# EAGLE design LoRa PiHat v.1 (EAGLE 9.5.2)
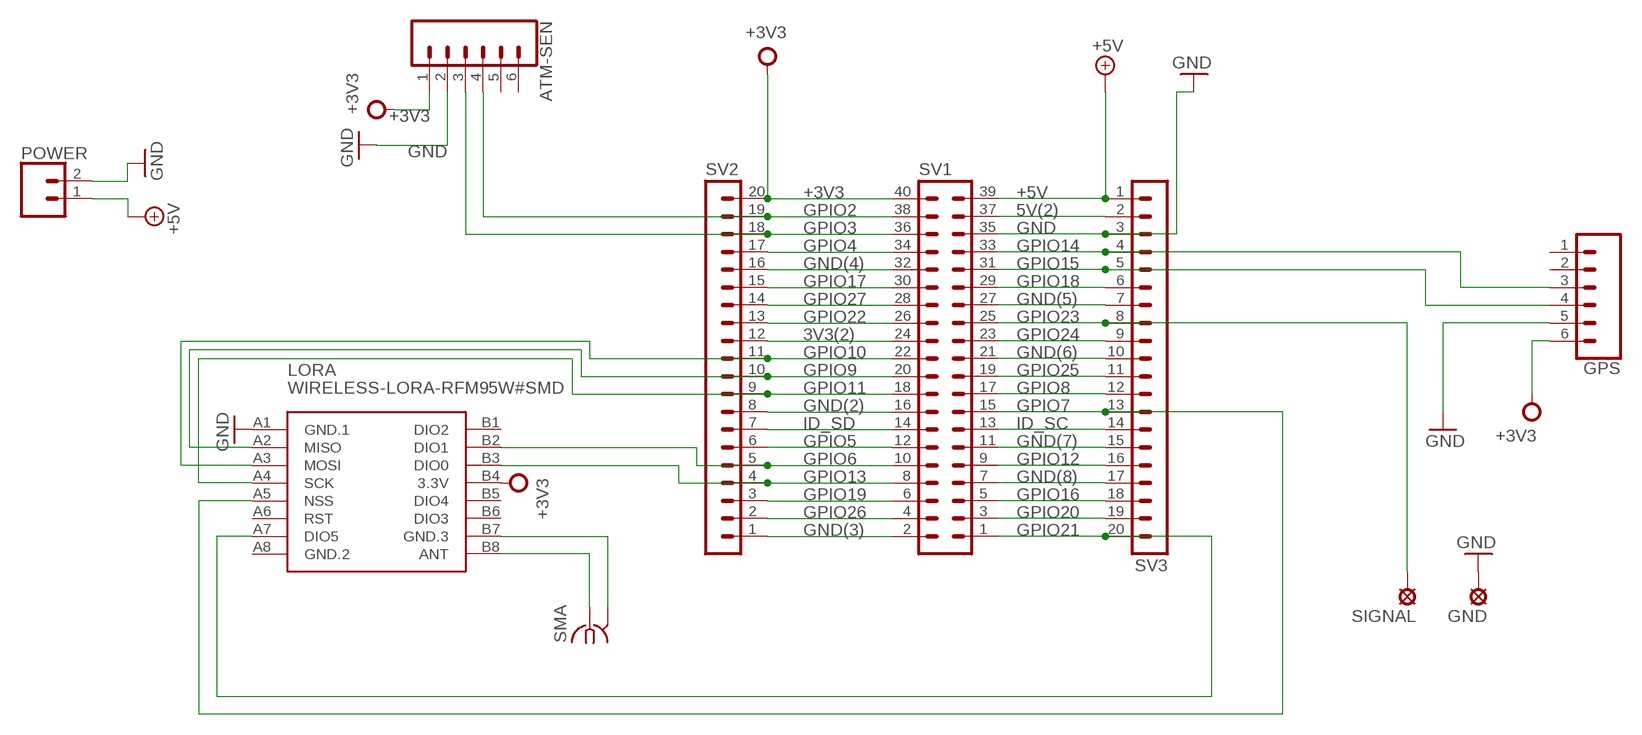
[diagram p0: schematic, sheet 1]

## Parts
ATM-SEN  CONN_06NO_SILK_NO_POP  [1X06_NO_SILK]
GND  LSP10  [LSP10]
GPS  CONN_06NO_SILK_NO_POP  [1X06_NO_SILK]
LORA  WIRELESS-LORA-RFM95W#SMD  [WIRELESS-LORA-RFM95W#SMD]
POWER  CONN_02  [1X02]
SIGNAL  LSP10  [LSP10]
SMA  BU-SMA-V  [BU-SMA-V]
SV1  MA20-2  [MA20-2]
SV2  MA20-1L  [MA20-1L]
SV3  MA20-1L  [MA20-1L]

## Nets
3V3(2): SV1.24 SV2.12
5V(2): SV1.37 SV3.2
+3V3: ATM-SEN.1 GPS.6 LORA.B4(3.3V) SV1.40 SV2.20
+5V: POWER.1 SV1.39 SV3.1
GND: ATM-SEN.2 GND.MP GPS.5 LORA.A1(GND.1) POWER.2 SV1.35 SV3.3
GND(2): SV1.16 SV2.8
GND(3): SV1.2 SV2.1
GND(4): SV1.32 SV2.16
GND(5): SV1.27 SV3.7
GND(6): SV1.21 SV3.10
GND(7): SV1.11 SV3.15
GND(8): SV1.7 SV3.17
GPIO2: ATM-SEN.4 SV1.38 SV2.19
GPIO3: ATM-SEN.3 SV1.36 SV2.18
GPIO4: SV1.34 SV2.17
GPIO5: SV1.12 SV2.6
GPIO6: LORA.B2(DIO1) SV1.10 SV2.5
GPIO7: LORA.A5(NSS) SV1.15 SV3.13
GPIO8: SV1.17 SV3.12
GPIO9: LORA.A2(MISO) SV1.20 SV2.10
GPIO10: LORA.A3(MOSI) SV1.22 SV2.11
GPIO11: LORA.A4(SCK) SV1.18 SV2.9
GPIO12: SV1.9 SV3.16
GPIO13: LORA.B3(DIO0) SV1.8 SV2.4
GPIO14: GPS.3 SV1.33 SV3.4
GPIO15: GPS.4 SV1.31 SV3.5
GPIO16: SV1.5 SV3.18
GPIO17: SV1.30 SV2.15
GPIO18: SV1.29 SV3.6
GPIO19: SV1.6 SV2.3
GPIO20: SV1.3 SV3.19
GPIO21: LORA.A7(DIO5) SV1.1 SV3.20
GPIO22: SV1.26 SV2.13
GPIO23: SIGNAL.MP SV1.25 SV3.8
GPIO24: SV1.23 SV3.9
GPIO25: SV1.19 SV3.11
GPIO26: SV1.4 SV2.2
GPIO27: SV1.28 SV2.14
ID_SC: SV1.13 SV3.14
ID_SD: SV1.14 SV2.7
N$1: LORA.B8(ANT) SMA.1
N$2: LORA.B7(GND.3) SMA.2 SMA.3 SMA.4 SMA.5
Unconnected: ATM-SEN.5 ATM-SEN.6 GPS.1 GPS.2 LORA.A6(RST) LORA.B1(DIO2) LORA.B5(DIO4) LORA.B6(DIO3)

## Power pins joined to a net without a drawn wire
GND.2: LORA.A8(GND.2)

## Library data of the parts
ATM-SEN GPS = SparkFun-Connectors:CONN_06: Multi connection point. Often used as Generic Header-pin footprint for 0.1 inch spaced/style header connections On any of the 0.1 inch spaced packages, you can populate with these: Break Away Headers - Straight <https://www.sparkfun.com/products/116> (PRT-00116) Break Away Male Headers - Right Angle <https://www.sparkfun.com/products/553> (PRT-00553) Female Headers <https://www.sparkfun.com/products/115> (PRT-00115) Break Away Headers - Machine Pin <https://www.sparkfun.com/products/117> (PRT-00117) Break Away Female Headers - Swiss Machine Pin <https://www.sparkfun.com/products/743> (PRT-00743) Arduino Stackable Header - 6 Pin <https://www.sparkfun.com/products/9280> (PRT-09280) For SCREWTERMINALS and SPRING TERMINALS visit here: Screw Terimnals on SparkFun.com <https://www.sparkfun.com/search/results?term=Screw+Terminals> (5mm/3.5mm/2.54mm spacing) This device is also useful as a general connection point to wire up your design to another part of your project. Our various solder wires solder well into these plated through hole pads. Hook-Up Wire - Assortment (Stranded, 22 AWG) <https://www.sparkfun.com/products/11375> (PRT-11375) Hook-Up Wire - Assortment (Solid Core, 22 AWG) <https://www.sparkfun.com/products/11367> (PRT-11367) View the entire wire category on our website here <https://www.sparkfun.com/categories/141>
GND SIGNAL = solpad:LSP10: SOLDER PAD drill 1.0 mm, distributor Buerklin, 12H555
LORA = diy-modules:WIRELESS-LORA-RFM95W: 868/915 MHz LoRa Radio Transceiver Module based on SX1276 chip Click here to find device on ebay.com <http://www.ebay.com/sch/RFM95W+transceiver>
POWER = SparkFun-Connectors:CONN_02: Multi connection point. Often used as Generic Header-pin footprint for 0.1 inch spaced/style header connections On any of the 0.1 inch spaced packages, you can populate with these: Break Away Headers - Straight <https://www.sparkfun.com/products/116> (PRT-00116) Break Away Male Headers - Right Angle <https://www.sparkfun.com/products/553> (PRT-00553) Female Headers <https://www.sparkfun.com/products/115> (PRT-00115) Break Away Headers - Machine Pin <https://www.sparkfun.com/products/117> (PRT-00117) Break Away Female Headers - Swiss Machine Pin <https://www.sparkfun.com/products/743> (PRT-00743) For SCREWTERMINALS and SPRING TERMINALS visit here: Screw Terimnals on SparkFun.com <https://www.sparkfun.com/search/results?term=Screw+Terminals> (5mm/3.5mm/2.54mm spacing) This device is also useful as a general connection point to wire up your design to another part of your project. Our various solder wires solder well into these plated through hole pads. Hook-Up Wire - Assortment (Stranded, 22 AWG) <https://www.sparkfun.com/products/11375> (PRT-11375) Hook-Up Wire - Assortment (Solid Core, 22 AWG) <https://www.sparkfun.com/products/11367> (PRT-11367) View the entire wire category on our website here <https://www.sparkfun.com/categories/141> Special notes: Molex polarized connector foot print use with: PRT-08233 with associated crimp pins and housings. 2.54_SCREWTERM for use with PRT-10571. 3.5mm Screw Terminal footprints for PRT-08084 5mm Screw Terminal footprints for use with PRT-08432
SMA = con-coax:BU-SMA-V: FEMALE SMA CONNECTOR Radiall distributor RS 112-3794; OC_FARNELL: unknown; OC_NEWARK: unknown
SV1 = con-lstb:MA20-2: PIN HEADER; OC_FARNELL: unknown; OC_NEWARK: unknown
SV2 SV3 = con-lstb:MA20-1L: PIN HEADER; OC_FARNELL: unknown; OC_NEWARK: unknown

## Board
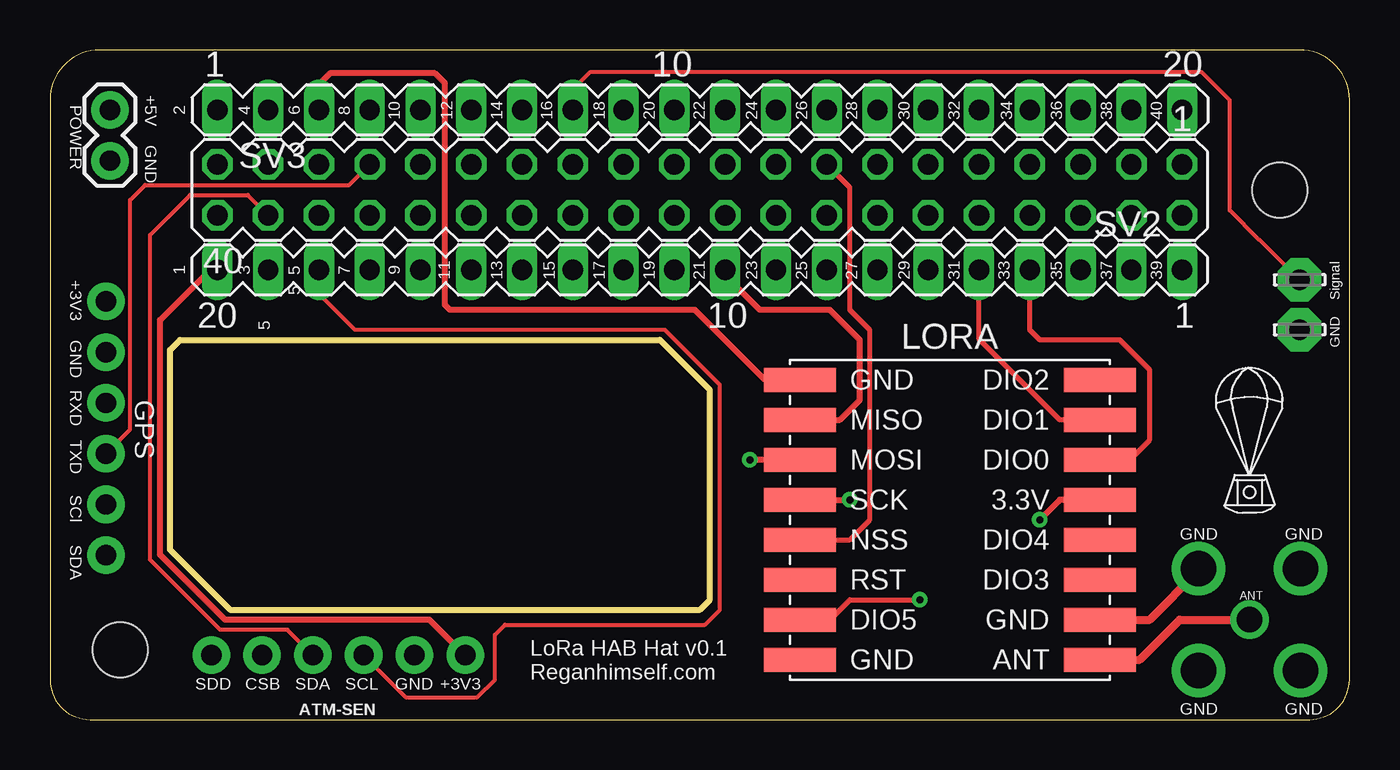
[diagram p1: board, top side]
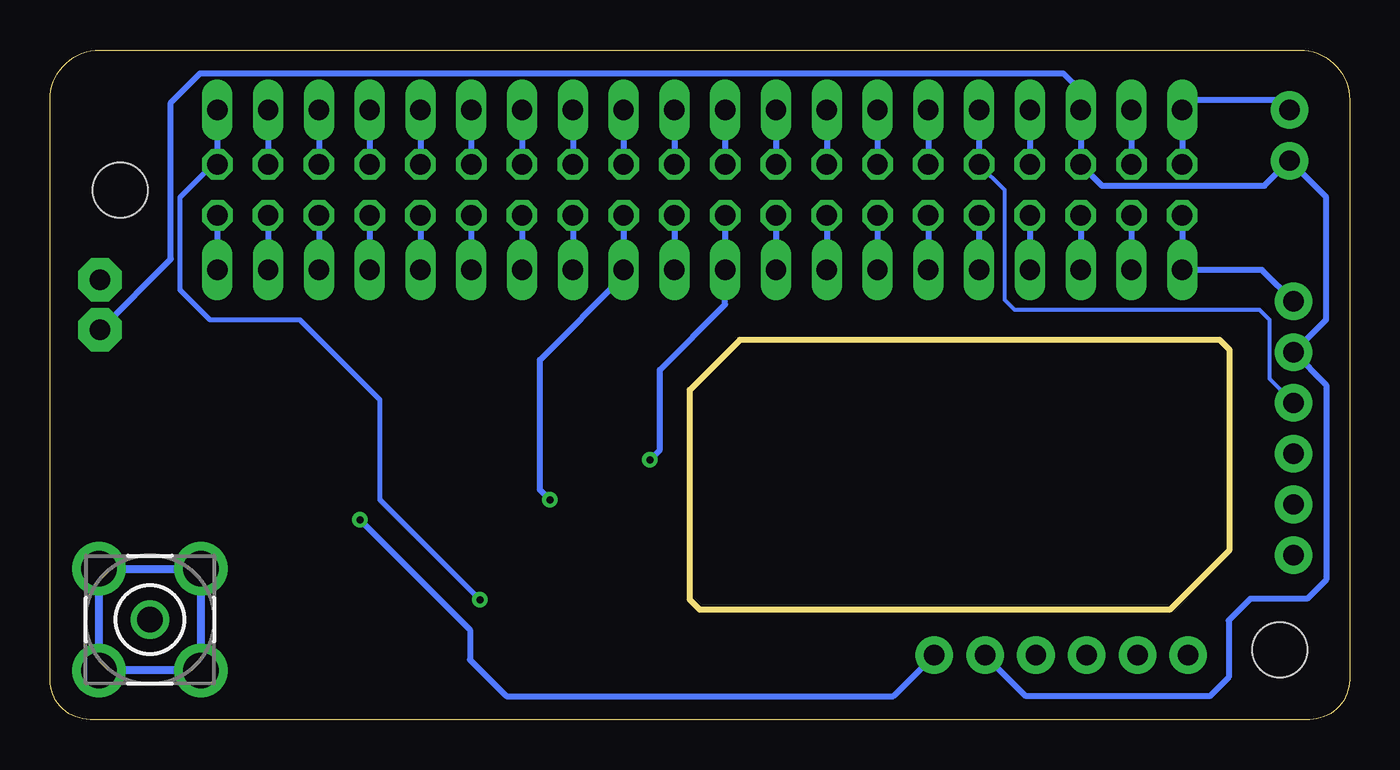
[diagram p2: board, bottom side, seen from below]

Size 65 x 33.5 mm. Coordinates in mm from the lower left corner, seen from the top.
Outline: 0,31 0,2 arc90 2,0 63,0 arc90 65,2 65,31 arc90 62.5,33.5 2.5,33.5 arc90 0,31
Copper layers (1*16): Top 0.035mm / dielectric 1.5mm / Bottom 0.035mm
Design rules "default": minimum track width 6mil, minimum drill 0.35mm, track to track 6mil, track to pad 6mil, pad to pad 6mil, via to via 6mil, smd to smd 6mil, copper to edge 40mil, drill to drill 6mil, minimum pad ring 10mil, minimum via ring 8mil, stop-mask expansion 4mil, vias tented up to drill 0mil, thermal gap 10mil
Holes 2.75 mm at 61.5,26.5 3.5,3.5
Milling: 8 lines

### Footprints (pad centres in the part's own frame; a part is rotated, then mirrored left to right if it is on the bottom)
1X06_NO_SILK = drill 1.016 pad 1.88: 1 0,0; 2 2.54,0; 3 5.08,0; 4 7.62,0; 5 10.16,0; 6 12.7,0
LSP10 = drill 1.016 pad 2.159 octagon: MP 0,0
WIRELESS-LORA-RFM95W#SMD = smd 3.6 x 1.2: A1 -7.5,7; A2 -7.5,5; A3 -7.5,3; A4 -7.5,1; A5 -7.5,-1; A6 -7.5,-3; A7 -7.5,-5; A8 -7.5,-7; B1 7.5,7; B2 7.5,5; B3 7.5,3; B4 7.5,1; B5 7.5,-1; B6 7.5,-3; B7 7.5,-5; B8 7.5,-7
1X02 = drill 1.016 pad 1.88: 1 0,0; 2 2.54,0
BU-SMA-V = drill 1.27: 1 0,0 | drill 1.778: 2 -2.55,2.55; 3 2.55,2.55; 4 2.55,-2.55; 5 -2.55,-2.55
MA20-2 = drill 1.016 octagon: 1 -24.13,-1.27; 2 -24.13,1.27; 3 -21.59,-1.27; 4 -21.59,1.27; 5 -19.05,-1.27; 6 -19.05,1.27; 7 -16.51,-1.27; 8 -16.51,1.27; 9 -13.97,-1.27; 10 -13.97,1.27; 11 -11.43,-1.27; 12 -11.43,1.27; 13 -8.89,-1.27; 14 -8.89,1.27; 15 -6.35,-1.27; 16 -6.35,1.27; 17 -3.81,-1.27; 18 -3.81,1.27; 19 -1.27,-1.27; 20 -1.27,1.27; 21 1.27,-1.27; 22 1.27,1.27; 23 3.81,-1.27; 24 3.81,1.27; 25 6.35,-1.27; 26 6.35,1.27; 27 8.89,-1.27; 28 8.89,1.27; 29 11.43,-1.27; 30 11.43,1.27; 31 13.97,-1.27; 32 13.97,1.27; 33 16.51,-1.27; 34 16.51,1.27; 35 19.05,-1.27; 36 19.05,1.27; 37 21.59,-1.27; 38 21.59,1.27; 39 24.13,-1.27; 40 24.13,1.27
MA20-1L = drill 1.016 long: 1 24.13,0; 2 21.59,0; 3 19.05,0; 4 16.51,0; 5 13.97,0; 6 11.43,0; 7 8.89,0; 8 6.35,0; 9 3.81,0; 10 1.27,0; 11 -1.27,0; 12 -3.81,0; 13 -6.35,0; 14 -8.89,0; 15 -11.43,0; 16 -13.97,0; 17 -16.51,0; 18 -19.05,0; 19 -21.59,0; 20 -24.13,0

### Placement (x,y rotation side)
ATM-SEN  20.77,3.22 180 top
GND  62.5,19.5 0 top
GPS  2.8,8.22 90 top
LORA  45,10 0 top
POWER  3,30.5 270 top
SIGNAL  62.5,22 0 top
SMA  60,5 0 bottom
SV1  32.5,26.5 180 top
SV2  32.5,22.5 0 top
SV3  32.5,30.5 180 top
U$1  [LOGO]  62.25,11.25 0 top

### Tracks (layer width: path | path; a pad name or v marks a point on that pad's centre or on a via)
3V3(2)
  Bottom 0.3: SV1.24 SV2.12
5V(2)
  Bottom 0.3: SV3.2 SV1.37
+3V3  (via drill 0.35)
  Top 0.2: 8,22.5 SV2.20
  Top 0.3: LORA.B4 50.5,11 v49.5,10 | ATM-SEN.1 18.98,5 8.75,5 5.5,8.25 5.5,18 5.5,18.5 5.5,20 8,22.5
  Bottom 0.3: SV1.40 SV2.20 4.38,22.5 GPS.6 | v49.5,10 44,4.5 44,3 42.17,1.17 22.82,1.17 ATM-SEN.1
+5V
  Bottom 0.3: SV1.39 SV3.1 7.87,31 3.5,31 POWER.1
GND
  Top 0.3: LORA.A1 35.75,17 32.25,20.5 20,20.5 19.75,20.75 19.75,31.83 19.25,32.33 14,32.33 13.45,31.78 SV3.3
  Bottom 0.3: ATM-SEN.2 16.18,1.17 7,1.17 6.04,2.12 6.04,4.96 4.96,6.04 2.12,6.04 1.17,7 1.17,16.75 GPS.5 1.18,20 1.17,20 1.17,26.13 POWER.2 4.25,26.71 12.39,26.71 SV1.35 SV3.3 13.45,31.45 14.33,32.33 57.5,32.33 58.96,30.88 58.96,23.04 GND.MP
GND(2)
  Bottom 0.3: SV1.16 SV2.8
GND(3)
  Bottom 0.3: SV1.2 SV2.1
GND(4)
  Bottom 0.3: SV1.32 SV2.16
GND(5)
  Bottom 0.3: SV3.7 SV1.27
GND(6)
  Bottom 0.3: SV3.10 SV1.21
GND(7)
  Bottom 0.3: SV3.15 SV1.11
GND(8)
  Bottom 0.3: SV3.17 SV1.7
GPIO2
  Top 0.2: ATM-SEN.4 11.86,4.5 8.5,4.5 5,8 5,24.25 7,26.25 9.89,26.25 SV1.38
  Bottom 0.3: SV1.38 SV2.19
GPIO3
  Top 0.2: ATM-SEN.3 17.79,1.12 21.37,1.12 22.25,2 22.25,4.25 22.75,4.75 32.75,4.75 33.5,5.5 33.5,16.75 30.75,19.5 15.25,19.5 13.45,21.3 SV2.18
  Bottom 0.2: 13.45,21.95 SV2.18
  Bottom 0.3: SV1.36 SV2.18
GPIO4
  Bottom 0.3: SV1.34 SV2.17
GPIO5
  Bottom 0.3: SV1.12 SV2.6
GPIO6
  Top 0.25: LORA.B2 50.5,15 46.47,19.03 SV2.5
  Bottom 0.3: SV1.10 SV2.5
GPIO7
  Top 0.25: LORA.A5 40,9 41,10 41,19.5 40,20.5 40,26.62 SV1.15
  Bottom 0.3: SV3.13 SV1.15
GPIO8
  Bottom 0.3: SV3.12 SV1.17
GPIO9
  Top 0.3: LORA.A2 39.5,15 40.5,16 40.5,19 39,20.5 35.5,20.5 33.77,22.23 SV2.10
  Bottom 0.3: SV1.20 SV2.10
GPIO10  (via drill 0.35)
  Top 0.3: LORA.A3 v35,13
  Bottom 0.3: SV1.22 SV2.11 31.23,20.77 34.5,17.5 34.5,13.5 v35,13
GPIO11  (via drill 0.35)
  Top 0.3: LORA.A4 v40,11
  Bottom 0.3: SV1.18 SV2.9 36.31,22.19 40.5,18 40.5,11.5 v40,11
GPIO12
  Bottom 0.3: SV3.16 SV1.9
GPIO13
  Top 0.152: 49.01,21.49 SV2.4
  Top 0.25: LORA.B3 54,13 55,14 55,17.5 53.5,19 49.5,19 49.01,19.49 SV2.4
  Bottom 0.3: SV1.8 SV2.4
GPIO14
  Top 0.2: GPS.3 4,14.5 4,26 4.75,26.75 14.97,26.75 SV1.33
  Bottom 0.3: SV3.4 SV1.33
GPIO15
  Bottom 0.2: GPS.4 4,17.04 4,20 4.5,20.5 16.75,20.5 17.25,21 17.25,26.49 SV1.31
  Bottom 0.3: SV3.5 SV1.31
GPIO16
  Bottom 0.3: SV3.18 SV1.5
GPIO17
  Bottom 0.3: SV1.30 SV2.15
GPIO18
  Bottom 0.3: SV3.6 SV1.29
GPIO19
  Bottom 0.3: SV1.6 SV2.3
GPIO20
  Bottom 0.3: SV3.19 SV1.3
GPIO21  (via drill 0.35)
  Top 0.25: LORA.A7 39,5 40,6 v43.5,6
  Bottom 0.25: v43.5,6 48.5,11 48.5,16 52.5,20 57,20 58.5,21.5 58.5,26.13 56.63,28
  Bottom 0.3: SV3.20 56.63,28 SV1.1
GPIO22
  Bottom 0.3: SV1.26 SV2.13
GPIO23
  Top 0.2: SV3.8 26.15,31.53 27,32.38 57.62,32.38 59,31 59,25.48 60.47,24.01 60.49,24.01 SIGNAL.MP
  Bottom 0.3: SV3.8 SV1.25
GPIO24
  Bottom 0.3: SV3.9 SV1.23
GPIO25
  Bottom 0.3: SV3.11 SV1.19
GPIO26
  Bottom 0.3: SV1.4 SV2.2
GPIO27
  Bottom 0.3: SV1.28 SV2.14
ID_SC
  Bottom 0.3: SV3.14 SV1.13
ID_SD
  Bottom 0.3: SV1.14 SV2.7
N$1
  Top 0.4: LORA.B8 54.5,3 56.5,5 SMA.1
N$2
  Top 0.4: LORA.B7 55,5 57.45,7.45 SMA.3
  Bottom 0.4: SMA.3 SMA.4 SMA.5 SMA.2 SMA.3

### Text on the board
tNames: POWER | +5V | 2 | 4 | 6 | 8 | 10 | 12 | 14 | 16 | 18 | 20 | 22 | 24 | 26 | 28 | 30 | 32 | 34 | 36 | 38 | 40 | GND | +3V3 | 1 | 3 | 5 | 7 | 9 | 11 | 13 | 15 | 17 | 19 | 21 | 23 | 25 | 27 | 29 | 31 | 33 | 35 | 37 | 39 | 5 | Signal | GND | 5 | GND | RXD | GPS | TXD | SCl | SDA | GND | GND | ANT | LoRa HAB Hat v0.1 / Reganhimself.com | SDD | CSB | SDA | SCL | GND | +3V3 | GND | GND